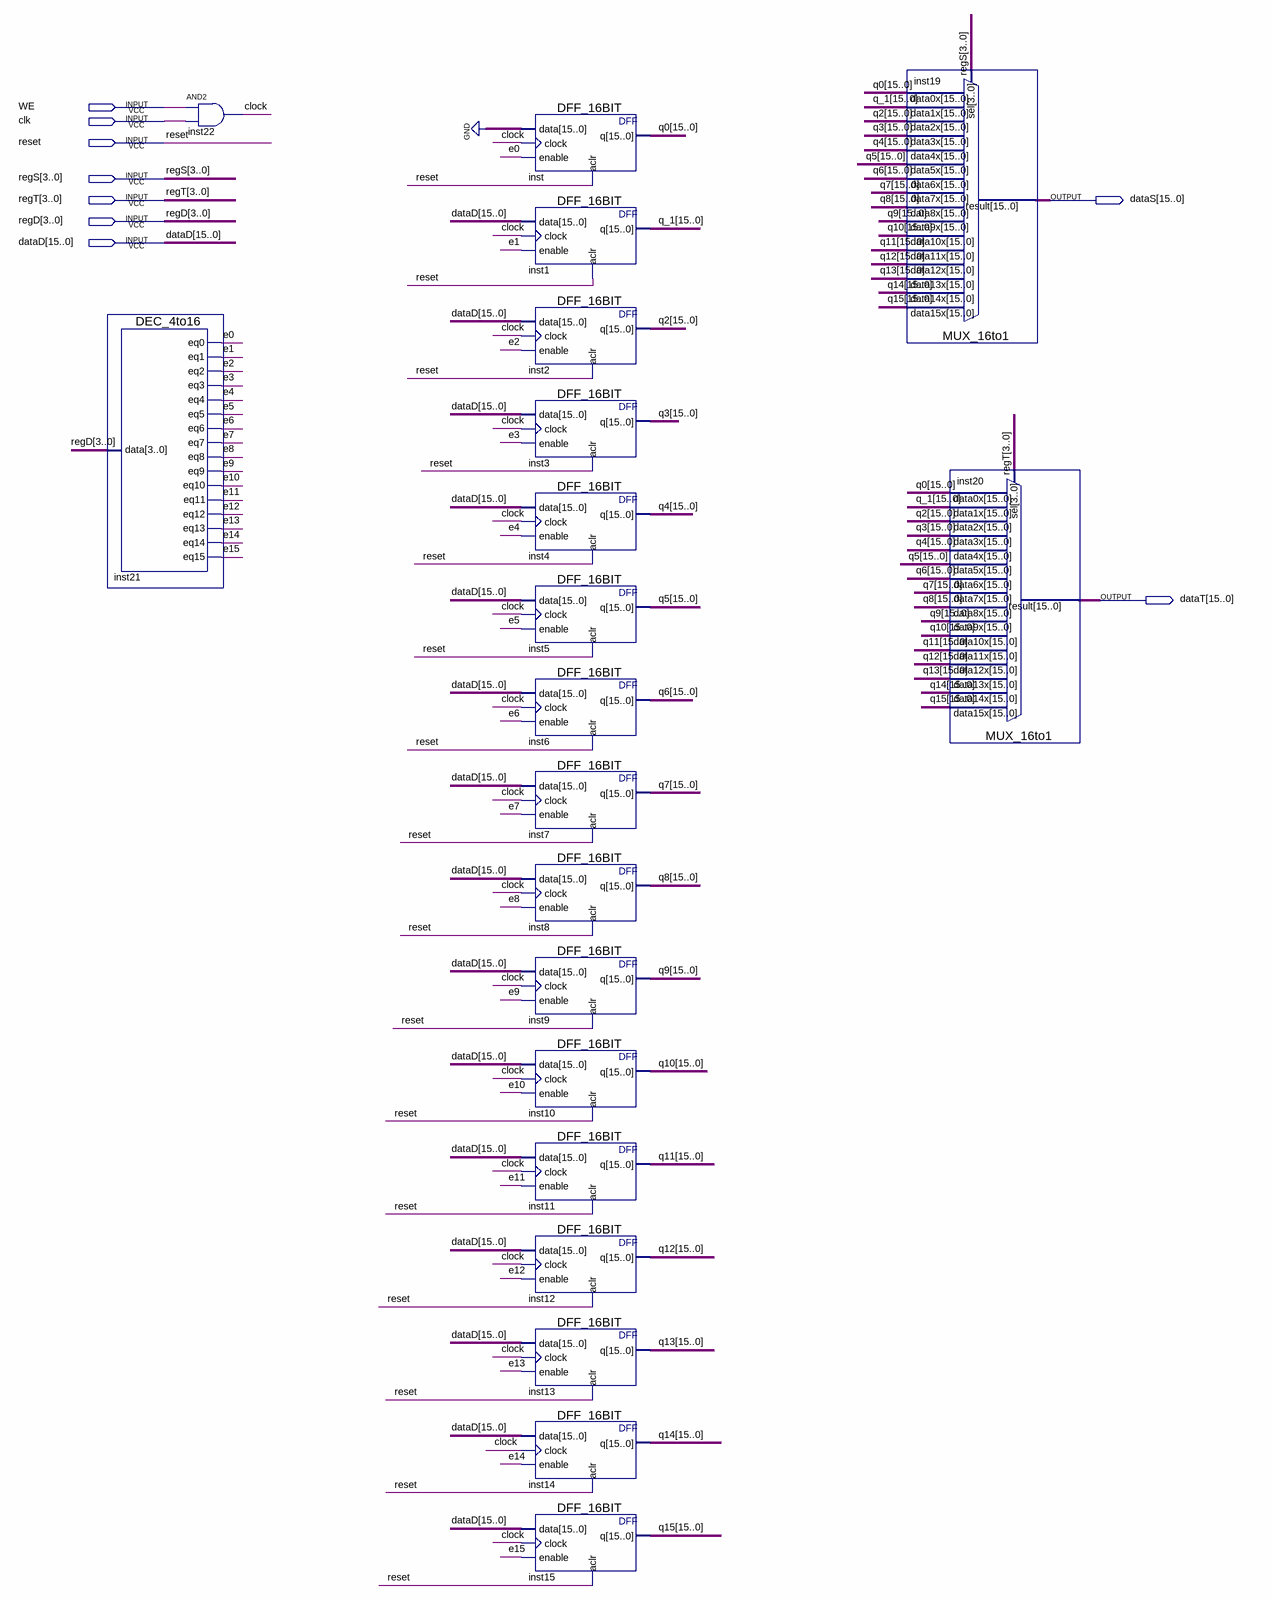
[diagram p0: schematic sheet]
// Quartus schematic lab8.bdf as structural Verilog: 20 symbols, 9 pins
module lab8 (
  input  WE,
  input  clk,
  input  reset,
  input  [3:0] regS,
  input  [3:0] regT,
  input  [3:0] regD,
  input  [15:0] dataD,
  output [15:0] dataS,
  output [15:0] dataT
);

  wire clock, e0, e1, e2, e3, e4, e5, e6, e7, e8, e9, e10, e11, e12, e13, e14, e15;
  wire [15:0] q0, q2, q3, q4, q5, q6, q7, q8, q9, q10, q11, q12, q13, q14, q15, q_1;

  DEC_4to16 inst21 (
    .data(regD), .eq0(e0), .eq1(e1), .eq2(e2), .eq3(e3), .eq4(e4), .eq5(e5), .eq6(e6), .eq7(e7), .eq8(e8),
    .eq9(e9), .eq10(e10), .eq11(e11), .eq12(e12), .eq13(e13), .eq14(e14), .eq15(e15));
  and inst22 (clock, WE, clk);
  DFF_16BIT inst (.data({16{1'b0}}), .clock(clock), .enable(e0), .aclr(reset), .q(q0));
  DFF_16BIT inst1 (.data(dataD), .clock(clock), .enable(e1), .aclr(reset), .q(q_1));
  DFF_16BIT inst2 (.data(dataD), .clock(clock), .enable(e2), .aclr(reset), .q(q2));
  DFF_16BIT inst3 (.data(dataD), .clock(clock), .enable(e3), .aclr(reset), .q(q3));
  DFF_16BIT inst4 (.data(dataD), .clock(clock), .enable(e4), .aclr(reset), .q(q4));
  DFF_16BIT inst5 (.data(dataD), .clock(clock), .enable(e5), .aclr(reset), .q(q5));
  DFF_16BIT inst6 (.data(dataD), .clock(clock), .enable(e6), .aclr(reset), .q(q6));
  DFF_16BIT inst7 (.data(dataD), .clock(clock), .enable(e7), .aclr(reset), .q(q7));
  DFF_16BIT inst8 (.data(dataD), .clock(clock), .enable(e8), .aclr(reset), .q(q8));
  DFF_16BIT inst9 (.data(dataD), .clock(clock), .enable(e9), .aclr(reset), .q(q9));
  DFF_16BIT inst10 (.data(dataD), .clock(clock), .enable(e10), .aclr(reset), .q(q10));
  DFF_16BIT inst11 (.data(dataD), .clock(clock), .enable(e11), .aclr(reset), .q(q11));
  DFF_16BIT inst12 (.data(dataD), .clock(clock), .enable(e12), .aclr(reset), .q(q12));
  DFF_16BIT inst13 (.data(dataD), .clock(clock), .enable(e13), .aclr(reset), .q(q13));
  DFF_16BIT inst14 (.data(dataD), .clock(clock), .enable(e14), .aclr(reset), .q(q14));
  DFF_16BIT inst15 (.data(dataD), .clock(clock), .enable(e15), .aclr(reset), .q(q15));
  MUX_16to1 inst19 (
    .data15x(q15), .data14x(q14), .data13x(q13), .data12x(q12), .data11x(q11), .data10x(q10), .data9x(q9),
    .data8x(q8), .data7x(q7), .data6x(q6), .data5x(q5), .data4x(q4), .data3x(q3), .data2x(q2), .data1x(q_1),
    .data0x(q0), .sel(regS), .result(dataS));
  MUX_16to1 inst20 (
    .data15x(q15), .data14x(q14), .data13x(q13), .data12x(q12), .data11x(q11), .data10x(q10), .data9x(q9),
    .data8x(q8), .data7x(q7), .data6x(q6), .data5x(q5), .data4x(q4), .data3x(q3), .data2x(q2), .data1x(q_1),
    .data0x(q0), .sel(regT), .result(dataT));
endmodule
